# Altium schematic sheet FPGA_52_SerialO.SchDoc
size A3; DocumentNumber: 1; SheetNumber: 1; SheetTotal: 1; Address1: L3, 12a Rodborough Rd; Address2: Frenchs Forest; Address3: NSW; Address4: Australia 2086; Organization: Altium Limited
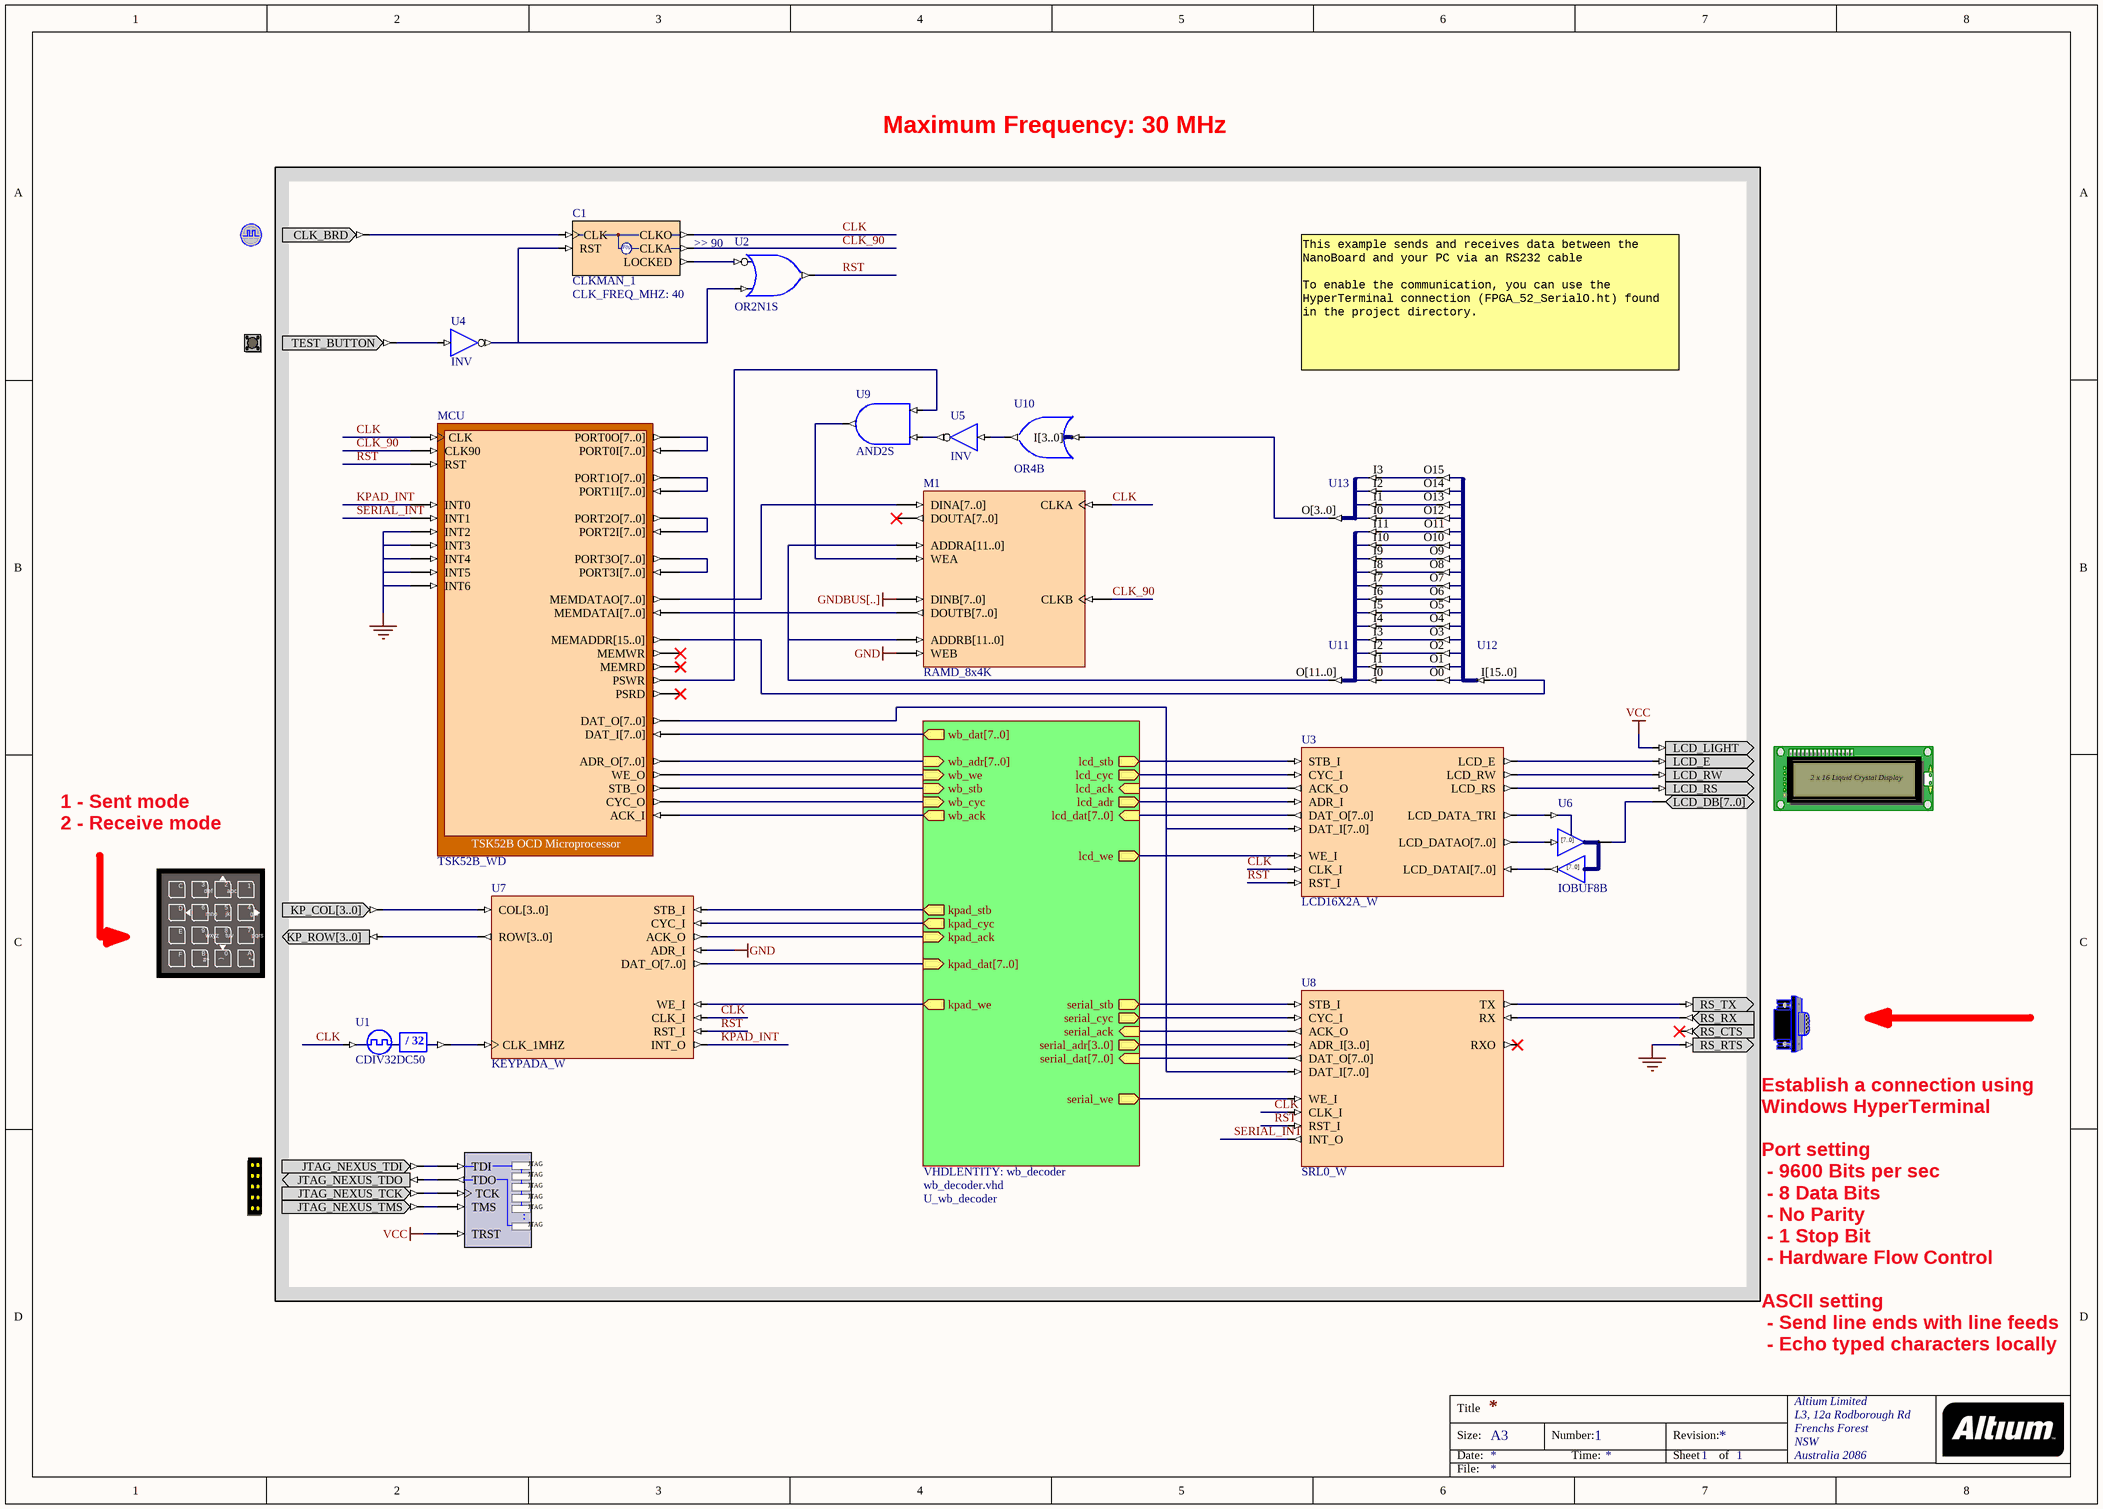
[diagram p0: FPGA_52_SerialO.SchDoc]

## Parts
(Parts that share a designator on the sheet are numbered #1, #2 ... from top to bottom, then left to right.)
?#1  CLOCK_BOARD  (value not drawn)
?#2  TEST_BUTTON  (value not drawn)
?#3  LCD  (value not drawn)
?#4  KEYPAD  (value not drawn)
?#5  RS232CNTR  (value not drawn)
?#6  NEXUS_JTAG_CONNECTOR  (value not drawn)
C1  CLKMAN_1  CLK_FREQ_MHZ: 40  ClkA_Operation: >> 90
M1  RAMD_8x4K
MCU  TSK52B_WD
NEXUS_JTAG_PORT  NEXUS_JTAG_PORT  (value not drawn)
U1  CDIV32DC50
U2  OR2N1S
U3  LCD16X2A_W
U4  INV
U5  INV
U6  IOBUF8B
U7  KEYPADA_W
U8  SRL0_W
U9  AND2S
U10  OR4B
U11  J12S_12B  (value not drawn)
U12  J16B_16S  (value not drawn)
U13  J4S_4B  (value not drawn)

## Sub-sheets
U_wb_decoder = wb_decoder.vhd: kpad_ack (in), kpad_cyc (out), kpad_dat[7..0] (in), kpad_stb (out), kpad_we (out), lcd_ack (in), lcd_adr (out), lcd_cyc (out), lcd_dat[7..0] (in), lcd_stb (out), lcd_we (out), serial_ack (in), serial_adr[3..0] (out), serial_cyc (out), serial_dat[7..0] (in), serial_stb (out), serial_we (out), wb_ack (out), wb_adr[7..0] (in), wb_cyc (in), wb_dat[7..0] (out), wb_stb (in), wb_we (in)  | VHDLENTITY: wb_decoder

## Nets
GND: ?#5.RS_RTS M1.WEB MCU.INT2 MCU.INT3 MCU.INT4 MCU.INT5 MCU.INT6 U7.ADR_I
GNDBUS[..]: M1.DINB[7..0]
VCC: ?#3.LCD_LIGHT NEXUS_JTAG_PORT.TRST
CLK: C1.CLKO M1.CLKA MCU.CLK U1.CLKIN U3.CLK_I U7.CLK_I U8.CLK_I
CLK_90: C1.CLKA M1.CLKB MCU.CLK90
KPAD_INT: MCU.INT0 U7.INT_O
RST: MCU.RST U2.O U3.RST_I U7.RST_I U8.RST_I
SERIAL_INT: MCU.INT1 U8.INT_O
Net?#1_CLK_BRD: ?#1.CLK_BRD C1.CLK
Net?#2_TEST_BUTTON: ?#2.TEST_BUTTON U4.I
Net?#3_LCD_DB[7..0]: ?#3.LCD_DB[7..0] U6.IO[7..0]
Net?#3_LCD_E: ?#3.LCD_E U3.LCD_E
Net?#3_LCD_RS: ?#3.LCD_RS U3.LCD_RS
Net?#3_LCD_RW: ?#3.LCD_RW U3.LCD_RW
Net?#4_KP_COL[3..0]: ?#4.KP_COL[3..0] U7.COL[3..0]
Net?#4_KP_ROW[3..0]: ?#4.KP_ROW[3..0] U7.ROW[3..0]
Net?#5_RS_RX: ?#5.RS_RX U8.RX
Net?#5_RS_TX: ?#5.RS_TX U8.TX
Net?#6_JTAG_NEXUS_TCK: ?#6.JTAG_NEXUS_TCK NEXUS_JTAG_PORT.TCK
Net?#6_JTAG_NEXUS_TDI: ?#6.JTAG_NEXUS_TDI NEXUS_JTAG_PORT.TDI
Net?#6_JTAG_NEXUS_TDO: ?#6.JTAG_NEXUS_TDO NEXUS_JTAG_PORT.TDO
Net?#6_JTAG_NEXUS_TMS: ?#6.JTAG_NEXUS_TMS NEXUS_JTAG_PORT.TMS
NetC1_LOCKED: C1.LOCKED U2.I0
NetC1_RST: C1.RST U2.I1 U4.O
NetM1_ADDRA[11..0]: M1.ADDRA[11..0] M1.ADDRB[11..0] U11.O[11..0]
NetM1_DINA[7..0]: M1.DINA[7..0] MCU.MEMDATAO[7..0]
NetM1_DOUTB[7..0]: M1.DOUTB[7..0] MCU.MEMDATAI[7..0]
NetM1_WEA: M1.WEA U9.O
NetMCU_ACK_I: MCU.ACK_I ; sheet U_wb_decoder/wb_ack
NetMCU_ADR_O[7..0]: MCU.ADR_O[7..0] ; sheet U_wb_decoder/wb_adr[7..0]
NetMCU_CYC_O: MCU.CYC_O ; sheet U_wb_decoder/wb_cyc
NetMCU_DAT_I[7..0]: MCU.DAT_I[7..0] ; sheet U_wb_decoder/wb_dat[7..0]
NetMCU_DAT_O[7..0]: MCU.DAT_O[7..0] U3.DAT_I[7..0] U8.DAT_I[7..0]
NetMCU_MEMADDR[15..0]: MCU.MEMADDR[15..0] U12.I[15..0]
NetMCU_PORT0I[7..0]: MCU.PORT0I[7..0] MCU.PORT0O[7..0]
NetMCU_PORT1I[7..0]: MCU.PORT1I[7..0] MCU.PORT1O[7..0]
NetMCU_PORT2I[7..0]: MCU.PORT2I[7..0] MCU.PORT2O[7..0]
NetMCU_PORT3I[7..0]: MCU.PORT3I[7..0] MCU.PORT3O[7..0]
NetMCU_PSWR: MCU.PSWR U9.I0
NetMCU_STB_O: MCU.STB_O ; sheet U_wb_decoder/wb_stb
NetMCU_WE_O: MCU.WE_O ; sheet U_wb_decoder/wb_we
NetU1_CLKDV: U1.CLKDV U7.CLK_1MHZ
NetU3_ACK_O: U3.ACK_O ; sheet U_wb_decoder/lcd_ack
NetU3_ADR_I: U3.ADR_I ; sheet U_wb_decoder/lcd_adr
NetU3_CYC_I: U3.CYC_I ; sheet U_wb_decoder/lcd_cyc
NetU3_DAT_O[7..0]: U3.DAT_O[7..0] ; sheet U_wb_decoder/lcd_dat[7..0]
NetU3_LCD_DATA_TRI: U3.LCD_DATA_TRI U6.T
NetU3_LCD_DATAI[7..0]: U3.LCD_DATAI[7..0] U6.O[7..0]
NetU3_LCD_DATAO[7..0]: U3.LCD_DATAO[7..0] U6.I[7..0]
NetU3_STB_I: U3.STB_I ; sheet U_wb_decoder/lcd_stb
NetU3_WE_I: U3.WE_I ; sheet U_wb_decoder/lcd_we
NetU5_I: U5.I U10.O
NetU5_O: U5.O U9.I1
NetU7_ACK_O: U7.ACK_O ; sheet U_wb_decoder/kpad_ack
NetU7_CYC_I: U7.CYC_I ; sheet U_wb_decoder/kpad_cyc
NetU7_DAT_O[7..0]: U7.DAT_O[7..0] ; sheet U_wb_decoder/kpad_dat[7..0]
NetU7_STB_I: U7.STB_I ; sheet U_wb_decoder/kpad_stb
NetU7_WE_I: U7.WE_I ; sheet U_wb_decoder/kpad_we
NetU8_ACK_O: U8.ACK_O ; sheet U_wb_decoder/serial_ack
NetU8_ADR_I[3..0]: U8.ADR_I[3..0] ; sheet U_wb_decoder/serial_adr[3..0]
NetU8_CYC_I: U8.CYC_I ; sheet U_wb_decoder/serial_cyc
NetU8_DAT_O[7..0]: U8.DAT_O[7..0] ; sheet U_wb_decoder/serial_dat[7..0]
NetU8_STB_I: U8.STB_I ; sheet U_wb_decoder/serial_stb
NetU8_WE_I: U8.WE_I ; sheet U_wb_decoder/serial_we
NetU10_I[3..0]: U10.I[3..0] U13.O[3..0]
NetU11_I0: U11.I0 U12.O0
NetU11_I1: U11.I1 U12.O1
NetU11_I2: U11.I2 U12.O2
NetU11_I3: U11.I3 U12.O3
NetU11_I4: U11.I4 U12.O4
NetU11_I5: U11.I5 U12.O5
NetU11_I6: U11.I6 U12.O6
NetU11_I7: U11.I7 U12.O7
NetU11_I8: U11.I8 U12.O8
NetU11_I9: U11.I9 U12.O9
NetU11_I10: U11.I10 U12.O10
NetU11_I11: U11.I11 U12.O11
NetU12_O12: U12.O12 U13.I0
NetU12_O13: U12.O13 U13.I1
NetU12_O14: U12.O14 U13.I2
NetU12_O15: U12.O15 U13.I3

Not connected (* = marked no-connect by the designer): ?#5 RS_CTS*; M1 DOUTA[7..0]*; MCU MEMRD* MEMWR* PSRD*; U8 RXO*

## Notes on the sheet
- Maximum Frequency: 30 MHz
- This example sends and receives data between the NanoBoard and your PC via an RS232 cable
  To enable the communication, you can use the HyperTerminal connection (FPGA_52_SerialO.ht) found in the project directory.
- 1 - Sent mode
  2 - Receive mode
- Establish a connection using Windows HyperTerminal
  Port setting
  - 9600 Bits per sec
  - 8 Data Bits
  - No Parity
  - 1 Stop Bit
  - Hardware Flow Control
  ASCII setting
  - Send line ends with line feeds
  - Echo typed characters locally
- Title
- Size:
- Date:
- A3
- Number:
- Time:
- Revision:
- Sheet
- of
- File:
- (in symbol CDIV32DC50) / 32
- (in symbol CLKMAN_1) F(x)
- (in symbol IOBUF8B) [7..0]
- (in symbol KEYPAD) C; 3; 2; 1; def; abc; 6; 5; 4; D; mno; jkl; ghi; E; 9; 8; 7; wxyz; tuv; pqrs; F; B; 0; A; #^; (; *+
- (in symbol LCD) 2 x 16 Liquid Crystal Display
- (in symbol NEXUS_JTAG_PORT) JTAG; .

## Library data of the parts
?#1 = CLOCK_BOARD: Global System Clock Supply; PortComponent: True; Published: 19-Nov-2003; Publisher: Altium Limited
?#2 = TEST_BUTTON: Test Button; PortComponent: True; Published: 19-Nov-2003; Publisher: Altium Limited
?#3 = LCD: Liquid Crystal Display; PortComponent: True; Published: 19-Nov-2003; Publisher: Altium Limited
?#4 = KEYPAD: Key Pad; PortComponent: True; Published: 19-Nov-2003; Publisher: Altium Limited
?#5 = RS232CNTR: DCE Serial Port Connector; PortComponent: True; Published: 19-Nov-2003; Publisher: Altium Limited
?#6 = NEXUS_JTAG_CONNECTOR: JTAG Port; PortComponent: True; Published: 19-Nov-2003; Publisher: Altium Limited
C1 = CLKMAN_1: Single Operational Output Clock Manager; Clk_Count: 1; Published: 5-Jul-2004; Publisher: Altium Limited; Core Revision: 1.00.00; Nexus_Core: ClockManager; HelpURL: CR0118 FPGA Generic Library Guide.pdf#page=148; Functional Class: Clock Manager; Port Size: 1
M1 = RAMD_8x4K: Dual Port Random Access Memory; Memory_DepthA: 4096; Memory_Type: RAM_DualPortBlock; Memory_WidthA: 8; Memory_ClockEdge: Rising; Nexus_Core: Memory_Program; Published: 13/01/2004; Publisher: Altium Hobart Technology Center; Memory_DepthB: 4096; Memory_WidthB: 8
MCU = TSK52B_WD: TSK52B OCD Microprocessor; NEXUS_CORE: Processor_OCDS; NEXUS_JTAG_DEVICE: True; NEXUS_JTAG_ORDER: 0; ChildModel1: TSK52B_WD_DRAM8X256; ChildCore1: M1; Memory_Configuration: Record[NEXUS_CORE]{}ComponentDesignator[iram]{}Memory_Depth[256]{}Memory_UsageType[ram]{}ProgramDownloadAddress[0x0]{}Memory_BusType[c51:idata_bus]{n}Record[NEXUS_CORE]{}ComponentDesignator[xram]{}Memory_Depth[64k]{}Memory_UsageType[ram]{}ProgramDownloadAddress[0x0]{}Memory_BusType[c51:xdata_bus]{n}Record[NEXUS_CORE]{}ComponentDesignator[xrom]{}Memory_Depth[64k]{}Memory_UsageType[rom]{}ProgramDownloadAddress[0x0]{}Memory_BusType[c51:code_bus]{n}; Published: 5/07/2004; Publisher: Altium Hobart Technology Centre; Core Revision: 1.00.00
NEXUS_JTAG_PORT = NEXUS_JTAG_PORT: Soft Nexus-Chain Connector; NEXUS_JTAG_CONNECTOR: True; Published: 18-Dec-2003; Publisher: Altium Limited
U1 = CDIV32DC50: Clock Divider by 32 with 50% Duty Cycle Output; Divisor Rate: 32; Duty Cycle: 50; ArchiveName: GENERIC; VHDLIB_SIM: GENERIC_LIB; Published: 29-Jan-2004; Publisher: Altium Limited; Core Revision: 1.00.00; HelpURL: CR0118 FPGA Generic Library Guide.pdf#page=142; Functional Class: Clock Divider
U2 = OR2N1S: 2-Input OR Gate with Active Low A Input, Single Pin Version; Xilinx Equivalent: OR2B1; ArchiveName: GENERIC; VHDLIB_SIM: GENERIC_LIB; Published: 29-Jan-2004; Publisher: Altium Limited; Core Revision: 1.00.00
U3 = LCD16X2A_W: LCD Controller Wishbone; Published: 9-Dec-2004; Publisher: Altium Limited; ComponentLink1Description: Core &Resource Usage; ComponentLink1URL: CR0139 FPGA Peripheral Resource Usage.pdf#page=17; HelpURL: CR0107 LCD16X2 LCD Controller.pdf#page=2; LastRevisionNo: 1.00.00
U4 U5 = INV: Inverter; ArchiveName: GENERIC; VHDLIB_SIM: GENERIC_LIB; Published: 29-Jan-2004; Publisher: Altium Limited; Xilinx Equivalent: INV; Core Revision: 1.00.00
U6 = IOBUF8B: 8-Bit Input/Output Buffer, Bus Version; ArchiveName: GENERIC; Published: 18-Dec-2003; Publisher: Altium Limited; Core Revision: 1.00.00
U7 = KEYPADA_W: Keypad Wishbone; Published: 9-Dec-2004; Publisher: Altium Limited; LastRevisionNo: 1.00.00; HelpURL: CR0106 Keypad Controller.pdf#page=2; ComponentLink1Description: Core &Resource Usage; ComponentLink1URL: CR0139 FPGA Peripheral Resource Usage.pdf#page=15
U8 = SRL0_W: Serial 0 Wishbone; Published: 9-Dec-2004; Publisher: Altium Limited; ComponentLink1Description: Core &Resource Usage; ComponentLink1URL: CR0139 FPGA Peripheral Resource Usage.pdf#page=41; HelpURL: CR0111 SRL0 Serial Port Unit.pdf#page=2; LastRevisionNo: 1.00.00
U9 = AND2S: 2-Input AND Gate, Single Pin Version; Xilinx Equivalent: AND2; ArchiveName: GENERIC; VHDLIB_SIM: GENERIC_LIB; Published: 29-Jan-2004; Publisher: Altium Limited; Core Revision: 1.00.00
U10 = OR4B: 4-Input OR Gate, Bus Version; ArchiveName: GENERIC; VHDLIB_SIM: GENERIC_LIB; Published: 29-Jan-2004; Publisher: Altium Limited; Core Revision: 1.00.00
U11 = J12S_12B: 12 Single pin inputs to single 12-Bit output bus; Functional Class: Bus Joiner; Port Size: 12; ArchiveName: GENERIC; VHDLIB_SIM: GENERIC_LIB; Published: 29-Jan-2004; Publisher: Altium Limited; Core Revision: 1.00.00; HelpURL: CR0118 FPGA Generic Library Guide.pdf#page=305
U12 = J16B_16S: Single 16-Bit input bus to 16 single pin outputs; Functional Class: Bus Joiner; Port Size: 16; ArchiveName: GENERIC; VHDLIB_SIM: GENERIC_LIB; Published: 29-Jan-2004; Publisher: Altium Limited; Core Revision: 1.00.00; HelpURL: CR0118 FPGA Generic Library Guide.pdf#page=303
U13 = J4S_4B: 4 Single pin inputs to single 4-Bit output bus; Functional Class: Bus Joiner; Port Size: 4; ArchiveName: GENERIC; VHDLIB_SIM: GENERIC_LIB; Published: 29-Jan-2004; Publisher: Altium Limited; Core Revision: 1.00.00; HelpURL: CR0118 FPGA Generic Library Guide.pdf#page=305